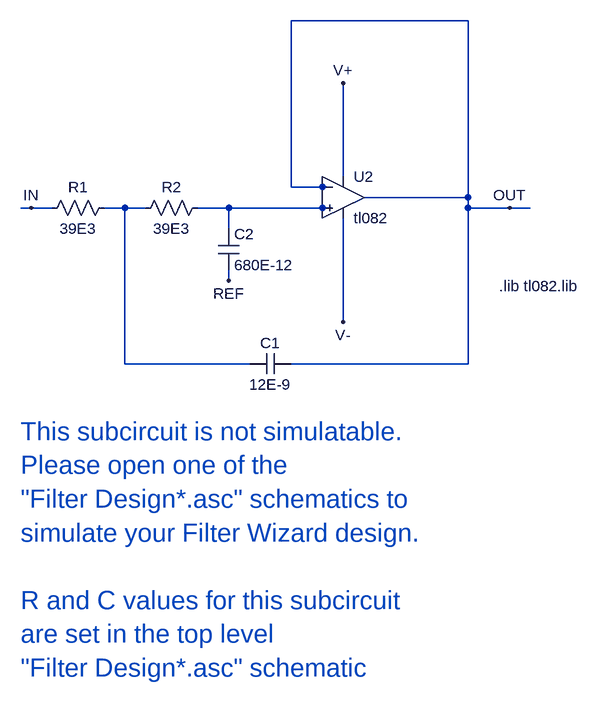
[diagram p0: schematic StageB_LowPassSallenKey_ADA4096.asc]
StageB_LowPassSallenKey_ADA4096.asc, the LTspice schematic file:
Version 4
SHEET 1 4112 860
WIRE 512 -128 240 -128
WIRE 320 112 320 -32
WIRE 240 128 240 -128
WIRE 288 128 288 112
WIRE 288 128 240 128
WIRE 304 128 288 128
WIRE 512 144 512 -128
WIRE 512 144 352 144
WIRE -160 160 -176 160
WIRE -128 160 -160 160
WIRE -16 160 -48 160
WIRE 16 160 -16 160
WIRE 144 160 96 160
WIRE 288 160 144 160
WIRE 512 160 512 144
WIRE 576 160 512 160
WIRE 608 160 576 160
WIRE 288 176 288 160
WIRE 144 192 144 160
WIRE 144 272 144 256
WIRE 320 336 320 176
WIRE -16 400 -16 160
WIRE 176 400 -16 400
WIRE 512 400 512 160
WIRE 512 400 240 400
FLAG 320 -32 V+
FLAG 320 336 V-
FLAG 576 160 OUT
FLAG -160 160 IN
FLAG 144 272 REF
SYMBOL res 112 144 R90
WINDOW 0 0 56 VBottom 2
WINDOW 3 32 56 VTop 2
SYMATTR InstName R2
SYMATTR Value 39E3
SYMBOL res -32 144 R90
WINDOW 0 0 56 VBottom 2
WINDOW 3 32 56 VTop 2
SYMATTR InstName R1
SYMATTR Value 39E3
SYMBOL cap 128 192 R0
SYMATTR InstName C2
SYMATTR Value 680E-12
SYMBOL cap 240 384 R90
WINDOW 0 0 32 VBottom 2
WINDOW 3 32 32 VTop 2
SYMATTR InstName C1
SYMATTR Value 12E-9
SYMBOL Opamps\\opamp2 320 80 R0
SYMATTR InstName U2
SYMATTR Value tl082
TEXT -176 504 Left 4 ;This subcircuit is not simulatable.  \nPlease open one of the \n"Filter Design*.asc" schematics to \nsimulate your Filter Wizard design.\n \nR and C values for this subcircuit\nare set in the top level \n"Filter Design*.asc" schematic
TEXT 560 280 Left 2 !.lib tl082.lib

The netlist it stands for:
* StageB_LowPassSallenKey_ADA4096.asc
R2 N002 N001 39E3
R1 N001 IN 39E3
C2 N002 REF 680E-12
C1 OUT N001 12E-9
XU2 N002 OUT V+ V- OUT tl082  ; pins In+ In- V+ V- OUT
* This subcircuit is not simulatable.
* Please open one of the
* "Filter Design*.asc" schematics to
* simulate your Filter Wizard design.
* R and C values for this subcircuit
* are set in the top level
* "Filter Design*.asc" schematic
.lib tl082.lib
.backanno
.end